# Altium schematic sheet voltage_adj_current_source.SchDoc: Voltage adjustable current source
size A4
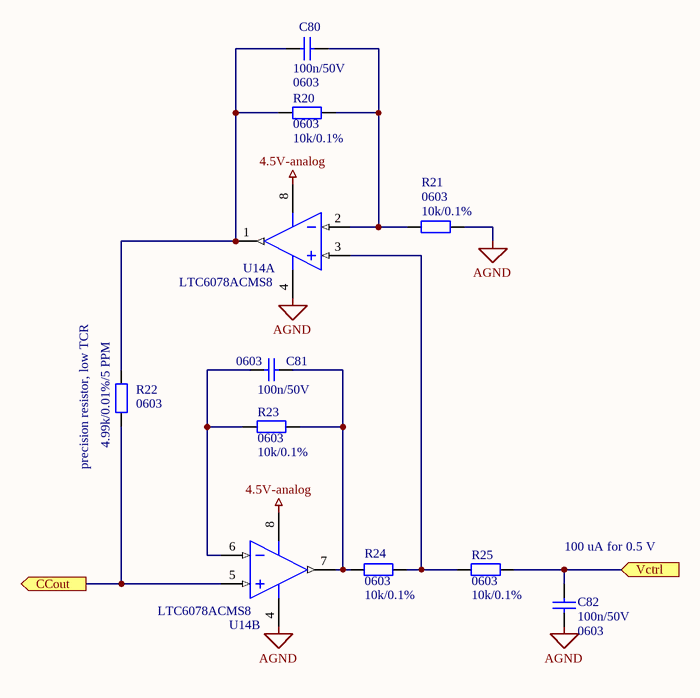
[diagram p0: voltage_adj_current_source.SchDoc]

## Parts
C80  Package: 0603  [SMD_Capacitor_0603]  (hidden comment: 100n/50V)
C81  Package: 0603  [SMD_Capacitor_0603]  (hidden comment: 100n/50V)
C82  Package: 0603  [SMD_Capacitor_0603]  (hidden comment: 100n/50V)
R20  0603  value 10k/0.1%  [SMD_Resistor_0603]
R21  0603  value 10k/0.1%  [SMD_Resistor_0603]
R22  0603  value 4.99k/0.01%/5 PPM  [SMD_Resistor_0603]
R23  0603  value 10k/0.1%  [SMD_Resistor_0603]
R24  0603  value 10k/0.1%  [SMD_Resistor_0603]
R25  0603  value 10k/0.1%  [SMD_Resistor_0603]
U14  LTC6078ACMS8  [LT-MS8-8_N]  (parts A,B of 2)

## Ports
CCout (out), Vctrl (in)

## Nets
4.5V-analog: U14.8(V+)
AGND: C82.1 R21.1 U14.4(V-)
CCout: R22.1 U14.5(+INB) ; port CCout
Vctrl: C82.2 R25.1 ; port Vctrl
NetC80_1: C80.1 R20.2 R22.2 U14.1(OUTA)
NetC80_2: C80.2 R20.1 R21.2 U14.2(-INA)
NetC81_1: C81.1 R23.2 U14.6(-INB)
NetC81_2: C81.2 R23.1 R24.2 U14.7(OUTB)
NetR24_1: R24.1 R25.2 U14.3(+INA)

## Notes on the sheet
- (near R22) precision resistor, low TCR
- 100 uA for 0.5 V
- Title:
- Sheet:
- of
- Author:
- Model:
- Document Number:
- Checked by:
- Iss-Rev:
- Approved by:
- Date:
- File name:

## Library data of the parts
C80-C82 = Cer_C0603T104K5RALTU: Ceramic Cap Kemet COTS 100n/50V X7R 0603; Manufacturer: Kemet; ManufacturerPartNumber: C0603T104K5RALTU; Value: 100n/50V
R20-R25 = Res2: Resistor; Published: 8-Jun-2000; LatestRevisionDate: 17-Jul-2002; LatestRevisionNote: Re-released for DXP Platform.; PackageReference: AXIAL-0.4; Publisher: Altium Limited; PackageDescription: Axial Device, Thru-Hole; 2 Leads; 0.4 in Pin Spacing
U14 = LTC6078ACMS8: Dual Channel, Micropower, Precision Operational Amplifier, RRIO, 0.75 MHz Typical GBW, 0.05 V/us Typical SR, 2.7 to 5.5 V, 8-Pin SOP (MS8-8), Commercial; Manufacturer: Linear Technology; Channels (#): 2; GBW (MHz) Typical: 0.75; Is (mA) Typical: 0.054; SR (V/us) Typical: 0.05; Vos (mV) Typical: 0.007; Vs Max (V): 5.5; Vs Min (V): 2.7; DatasheetVersion: Rev. A; PackageVersion: Rev G; PackageReference: LT-MS8-8; PackageDescription: 8-Lead Plastic Small Outline, Body 3.9 x 4.9 mm, Pitch 1.27 mm; Supplier 1: Digi-Key; Supplier Part Number 1: LTC6078ACMS8-ND; Supplier 2: Newark; Supplier Part Number 2: 56M9730; Linear Technology Part Number: LTC6078; Type: VFB; Mounting Technology: Surface Mount; PartNumber: LTC6078ACMS8; ComponentLink1Description: Manufacturer URL; ComponentLink1URL: http://www.linear.com/; ComponentLink2Description: Datasheet; ComponentLink2URL: http://cds.linear.com/docs/en/datasheet/60789fa.pdf; ComponentLink3Description: Package Specification; ComponentLink3URL: http://cds.linear.com/docs/en/packaging/05081610_G_SO8.pdf